# Altium schematic sheet 1_P1.schdoc
size 307 x 218 mm; Symbol: Drawing-Symbol_A4; Device: Drawing-Symbol_A4; Company: 嘉立创EDA; Version: V1.0; Page Size: A4; @Project Name: New Project_2025-01-19_22-01-16; @Page Count: 1; @Update Date: 2025-10-29; @Create Date: 2025-10-29; @Schematic Name: Schematic2; @Page No: 1; @Page Name: P1; @Create Time: 14:41:04; @Update Time: 22:41:04; Width: 1170; Height: 825; Region Start: 1; X Region Count: 6; Y Region Count: 4; Blade Width: 10; Title Block Position: 3; @Board Name: Board2
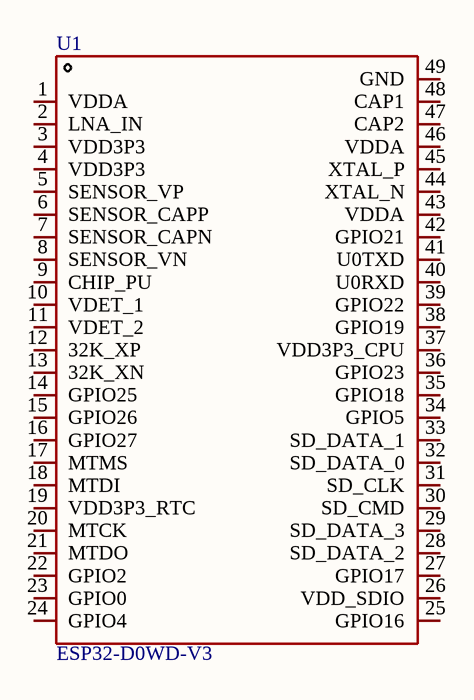
[diagram p0: 1_P1.schdoc]

## Parts
U1  ESP32-D0WD-V3  [QFN-48_L5.0-W5.0-P0.35-BL-EP3.7]

## Nets

Not connected (* = marked no-connect by the designer): U1 1(VDDA) 2(LNA_IN) 3(VDD3P3) 4(VDD3P3) 5(SENSOR_VP) 6(SENSOR_CAPP) 7(SENSOR_CAPN) 8(SENSOR_VN) 9(CHIP_PU) 10(VDET_1) 11(VDET_2) 12(32K_XP) 13(32K_XN) 14(GPIO25) 15(GPIO26) 16(GPIO27) 17(MTMS) 18(MTDI) 19(VDD3P3_RTC) 20(MTCK) 21(MTDO) 22(GPIO2) 23(GPIO0) 24(GPIO4) 25(GPIO16) 26(VDD_SDIO) 27(GPIO17) 28(SD_DATA_2) 29(SD_DATA_3) 30(SD_CMD) 31(SD_CLK) 32(SD_DATA_0) 33(SD_DATA_1) 34(GPIO5) 35(GPIO18) 36(GPIO23) 37(VDD3P3_CPU) 38(GPIO19) 39(GPIO22) 40(U0RXD) 41(U0TXD) 42(GPIO21) 43(VDDA) 44(XTAL_N) 45(XTAL_P) 46(VDDA) 47(CAP2) 48(CAP1) 49(GND)

## Notes on the sheet
- 1
- 2
- 3
- 4
- 5
- 6
- A
- B
- C
- 原理图
- Schematic2
- 创建日期
- 更新日期
- 2025-10-29
- 板子
- 绘制
- Board2
- 图页
- P1
- D
- 审阅
- 版本
- 尺寸
- New Project_2025-01-19_22-01-16
- 页    1    共    1
- V1.0
- A4
- 嘉立创EDA

## Library data of the parts
U1 = ESP32-D0WD-V3: Manufacturer: ESPRESSIF(乐鑫); Add into BOM: yes; Frequency Range: 2.412GHz~2.484GHz; Interface: ADC,GPIO,I2C,I2S,JTAG,PCM,PWM,SDIO,SPI,UART; Operating Voltage: 2.3V~3.6V; Output Power: 20.5dBm; Data Rate: 150Mbps; Current Of Transmitting: 180mA; Sensitivity: -93dBm; Receive Current: 95mA; Typical Application Frequency: 2.4GHz; Symbol: ESP32-D0WD-V3; Device: ESP32-D0WD-V3; LCSC Part Name: 集成2.4GHz WIFI和蓝牙双模的单芯片方案; Supplier Part: C967021; Manufacturer Part: ESP32-D0WD-V3; Supplier Footprint: QFN-48-EP(5x5); JLCPCB Part Class: 扩展库; Datasheet: https://atta.szlcsc.com/upload/public/pdf/source/20241030/ED17FC49A1F3B521B8AB27BB966A5465.pdf; Supplier: LCSC; Convert to PCB: yes; Applications: WiFi；蓝牙；IoT; Operating Temperature: -40℃~+125℃